# EAGLE design usb_rs232 (EAGLE 5.06)
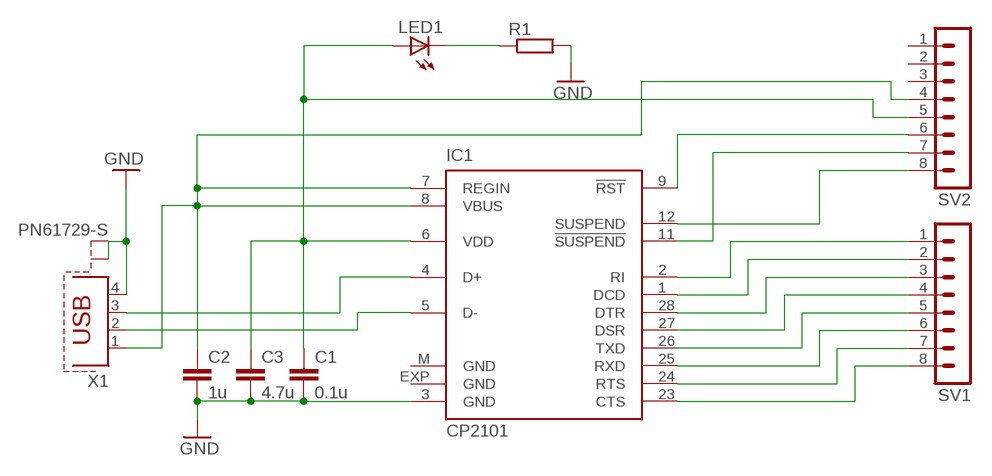
[diagram p0: schematic, sheet 1]

## Parts
C1  0.1u  C-EU050-025X075  [C050-025X075]
C2  1u  C-EUC0805K  [C0805K]
C3  4.7u  C-EUC0805K  [C0805K]
IC1  CP2101  [MLP28]
LED1  LED3MM  [LED3MM]
R1  R-EU_0207/10  [0207/10]
SV1  MA08-1  [MA08-1]
SV2  MA08-1  [MA08-1]
X1  PN61729-S  [PN61729-S]

## Nets
GND: C1.2 C2.2 C3.2 IC1.3(GND) R1.2 X1.4 X1.S1 X1.S2
N$1: C2.1 IC1.7(REGIN) IC1.8(VBUS) SV2.4 X1.1
N$2: IC1.28(DTR) SV1.3
N$3: C1.1 C3.1 IC1.6(VDD) LED1.A SV2.5
N$5: IC1.27(DSR) SV1.4
N$6: IC1.26(TXD) SV1.5
N$7: IC1.25(RXD) SV1.6
N$8: IC1.24(RTS) SV1.7
N$9: IC1.23(CTS) SV1.8
N$10: IC1.1(DCD) SV1.2
N$11: IC1.2(RI) SV1.1
N$12: IC1.4(D+) X1.3
N$13: IC1.5(D-) X1.2
N$18: LED1.K(C) R1.1
N$26: IC1.11(!SUSPEND) SV2.7
N$27: IC1.12(SUSPEND) SV2.8
N$28: IC1.9(!RST) SV2.6
Unconnected: SV2.1 SV2.2 SV2.3

## Power pins joined to a net without a drawn wire
GND: IC1.EXP(GND) IC1.M(GND)

## Library data of the parts
C1-C3 = bar-rcl:C-EU: CAPACITOR, European symbol
IC1 = silabs:CP210*: Single-Chip USB to UART Bridge Source: www.silabs.com .. CP2101.pdf / cp2102.pdf
LED1 = bar-diode-trans:LED: LED OSRAM: - CHIPLED LG R971, LG N971, LY N971, LG Q971, LY Q971, LO R971, LY R971 LH N974, LH R974 LS Q976, LO Q976, LY Q976 LO Q996 - Hyper CHIPLED LW Q18S LB Q993, LB Q99A, LB R99A - SideLED LS A670, LO A670, LY A670, LG A670, LP A670 LB A673, LV A673, LT A673, LW A673 LH A674 LY A675 LS A676, LA A676, LO A676, LY A676, LW A676 LS A679, LY A679, LG A679 - Hyper Micro SIDELED® LS Y876, LA Y876, LO Y876, LY Y876 LT Y87S - SmartLED LW L88C, LW L88S LB L89C, LB L89S, LG L890 LS L89K, LO L89K, LY L89K LS L896, LA L896, LO L896, LY L896 - TOPLED LS T670, LO T670, LY T670, LG T670, LP T670 LSG T670, LSP T670, LSY T670, LOP T670, LYG T670 LG T671, LOG T671, LSG T671 LB T673, LV T673, LT T673, LW T673 LH T674 LS T676, LA T676, LO T676, LY T676, LB T676, LH T676, LSB T676, LW T676 LB T67C, LV T67C, LT T67C, LS T67K, LO T67K, LY T67K, LW E67C LS E67B, LA E67B, LO E67B, LY E67B, LB E67C, LV E67C, LT E67C LW T67C LS T679, LY T679, LG T679 LS T770, LO T770, LY T770, LG T770, LP T770 LB T773, LV T773, LT T773, LW T773 LH T774 LS E675, LA E675, LY E675, LS T675 LS T776, LA T776, LO T776, LY T776, LB T776 LHGB T686 LT T68C, LB T68C - Hyper Mini TOPLED® LB M676 - Mini TOPLED Santana® LG M470 LS M47K, LO M47K, LY M47K Source: http://www.osram.convergy.de/
R1 = bar-rcl:R-EU_: RESISTOR, European symbol
SV1 SV2 = bar-con:MA08-1: PIN HEADER
X1 = con-berg:PN61729-S: BERG USB connector

## Board
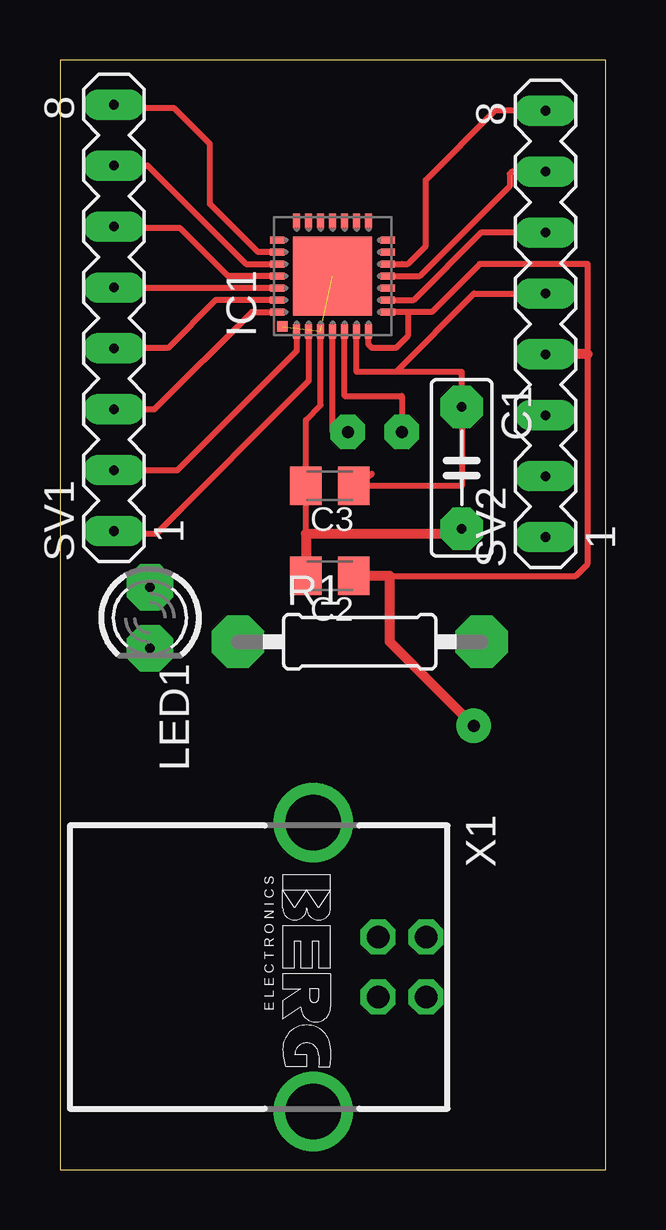
[diagram p1: board, top side]
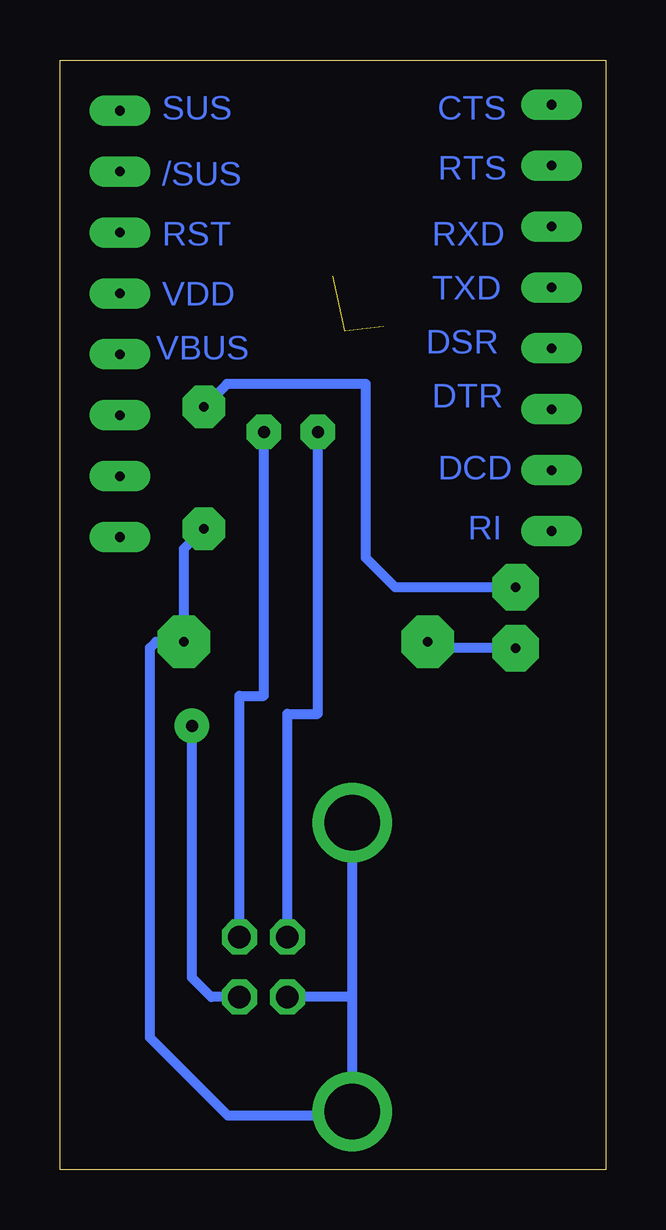
[diagram p2: board, bottom side, seen from below]

Size 22.75 x 46.25 mm. Coordinates in mm from the lower left corner, seen from the top.
Outline: 0,0 22.75,0 22.75,46.25 0,46.25 0,0
Copper layers (1*16): Top 0.035mm / dielectric 1.5mm / Bottom 0.035mm
Design rules "default *": minimum track width 10mil, minimum drill 24mil, track to track 0.0025mm, track to pad 0.0025mm, pad to pad 0.0025mm, via to via 1mil, smd to smd 1mil, copper to edge 40mil, drill to drill 5mil, minimum pad ring 10mil, minimum via ring 8mil, stop-mask expansion 4mil, vias tented up to drill 0mil, thermal gap 10mil

### Footprints (pad centres in the part's own frame; a part is rotated, then mirrored left to right if it is on the bottom)
C050-025X075 = drill 0.406 pad 1.778 octagon: 1 -2.54,0; 2 2.54,0
C0805K = smd 1.3 x 1.6: 1 -1,0; 2 1,0
MLP28 = smd 0.6 x 0.3: 1 -2.3,1.5; 2 -2.3,1; 3 -2.3,0.5; 4 -2.3,0; 5 -2.3,-0.5; 6 -2.3,-1; 7 -2.3,-1.5; 15 2.3,-1.5; 16 2.3,-1; 17 2.3,-0.5; 18 2.3,0; 19 2.3,0.5; 20 2.3,1; 21 2.3,1.5 | smd 0.3 x 0.6: 8 -1.5,-2.3; 9 -1,-2.3; 10 -0.5,-2.3; 11 0,-2.3; 12 0.5,-2.3; 13 1,-2.3; 14 1.5,-2.3; 22 1.5,2.3; 23 1,2.3; 24 0.5,2.3; 25 0,2.3; 26 -0.5,2.3; 27 -1,2.3; 28 -1.5,2.3 | smd 3.3 x 3.3: EXP 0,0 | smd 0.435 x 0.435: M -2.103,2.103
LED3MM = drill 0.406 pad 1.93 octagon: A -1.27,0; K 1.27,0
0207/10 = drill 0.406 pad 2.184 octagon: 1 -5.08,0; 2 5.08,0
MA08-1 = drill 0.406 pad 1.27 long: 1 -8.89,0; 2 -6.35,0; 3 -3.81,0; 4 -1.27,0; 5 1.27,0; 6 3.81,0; 7 6.35,0; 8 8.89,0
PN61729-S = drill 0.95 octagon: 1 1.25,4.71; 2 -1.25,4.71; 3 -1.25,2.71; 4 1.25,2.71 | drill 2.3 pad 2.9 round: S1 -6.02,0; S2 6.02,0

### Placement (x,y rotation side)
C1  16.75,29.25 270 top
C2  11.25,24.75 180 top
C3  11.25,28.5 180 top
IC1  11.37,37.24 90 top
LED1  3.75,23 270 top
R1  12.5,22 0 top
SV1  2.25,35.5 90 top
SV2  20.25,35.25 90 top
X1  10.56,8.44 270 top

### Tracks (layer width: path | path; a pad name or v marks a point on that pad's centre or on a via)
GND  (2 unrouted)
  Top 0.254: IC1.3 10.87,31.87 10.25,31.25 C3.2 10.25,26.5
  Top 0.406: C2.2 10.25,26.5 15.96,26.5 C1.2
  Bottom 0.406: 10.56,7.25 X1.S2 10.73,2.25 15.75,2.25 19,5.5 19,21.75 18.75,22 R1.2 17.58,25.88 C1.2 | 10.56,7.25 X1.S1 | X1.4 10.62,7.19 10.56,7.25
N$1  (via drill 0.5 pad 1.42)
  Top 0.254: IC1.7 12.87,34.38 13,34.25 14,34.25 14.5,34.75 14.5,35.75 | 14.5,35.75 IC1.8 | 14.5,35.75 15.5,35.75 17.5,37.75 22,37.75 22,34 22,25.25 21.5,24.75 13.75,24.75
  Top 0.406: C2.1 13.75,24.75 13.75,22 v17.25,18.5 | SV2.4 22,33.98 22,34
  Bottom 0.406: X1.1 16.44,7.19 17.25,8 v17.25,18.5
N$2
  Top 0.254: SV1.3 3.94,31.69 8,35.75 IC1.28
N$3
  Top 0.254: IC1.6 12.37,33.25 14,33.25 | SV2.5 17.27,36.52 14,33.25 | C1.1 16.71,31.75 | 13,29 C3.1 16.75,28.5 C1.1 | 14,33.25 16.75,33.25 C1.1
  Bottom 0.406: LED1.A 8.77,24.27 10,25.5 10,32.75 15.79,32.75 C1.1
N$5
  Top 0.254: IC1.27 6.49,36.24 4.5,34.25 2.27,34.25 SV1.4
N$6
  Top 0.254: IC1.26 2.28,36.74 SV1.5
N$7
  Top 0.254: IC1.25 7.01,37.24 5,39.25 2.31,39.25 SV1.6
N$8
  Top 0.254: SV1.7 3.65,41.85 7.75,37.75 IC1.24
N$9
  Top 0.254: IC1.23 8.26,38.24 6.25,40.25 6.25,42.75 4.75,44.25 2.39,44.25 SV1.8
N$10
  Top 0.254: SV1.2 4.9,29.15 9.87,34.12 IC1.1
N$11
  Top 0.254: IC1.2 10.37,32.87 4,26.5 2.36,26.5 SV1.1
N$12  (via drill 0.5 pad 1.42)
  Top 0.254: IC1.4 11.37,30.75 v12,30.75
  Bottom 0.406: X1.3 13.27,19 12,19 v12,30.75
N$13  (via drill 0.5 pad 1.42)
  Top 0.254: IC1.5 11.87,32.25 14.25,32.25 v14.25,30.75
  Bottom 0.406: X1.2 15.27,19.75 14.25,19.75 v14.25,30.75
N$18
  Bottom 0.406: LED1.K 7.15,21.73 R1.1
N$26
  Top 0.254: SV2.7 18.85,41.6 18.75,41.5 18.75,41 15,37.25 IC1.11
N$27
  Top 0.254: IC1.12 14.24,37.74 14.25,37.75 14.5,37.75 15.25,38.5 15.25,41.25 18.14,44.14 SV2.8
N$28
  Top 0.254: IC1.9 14.75,36.25 17.56,39.06 SV2.6
N$32  (via drill 0.5 pad 1.42)
  other vias: 12,30.75
N$33  (via drill 0.5 pad 1.42)
  other vias: 14.25,30.75

### Text on the board
Bottom: CTS | SUS | RTS | /SUS | RXD | RST | TXD | VDD | DSR | VBUS | DTR | DCD | RI